# Vivado block design StreamingDataflowPartition_1, xc7z020clg400-1, Vivado 2020.1
create_bd_design StreamingDataflowPartition_1

create_bd_intf_port -mode Slave -vlnv xilinx.com:interface:axis_rtl:1.0 s_axis_0
set_property -dict [list \
  CONFIG.TDATA_NUM_BYTES 1 \
  CONFIG.TDEST_WIDTH 0 \
  CONFIG.TID_WIDTH 0 \
  CONFIG.TUSER_WIDTH 0 \
  CONFIG.HAS_TREADY 1 \
  CONFIG.HAS_TSTRB 0 \
  CONFIG.HAS_TKEEP 0 \
  CONFIG.HAS_TLAST 0 \
  CONFIG.FREQ_HZ 100000000.000000 \
  CONFIG.LAYERED_METADATA undef \
] [get_bd_intf_ports s_axis_0]
create_bd_intf_port -mode Master -vlnv xilinx.com:interface:axis_rtl:1.0 m_axis_0
set_property -dict {CONFIG.FREQ_HZ 100000000.000000} [get_bd_intf_ports m_axis_0]
create_bd_port -dir I -type clk ap_clk
set_property -dict {CONFIG.FREQ_HZ 100000000.000000} [get_bd_ports ap_clk]
create_bd_port -dir I -type rst ap_rst_n

create_bd_cell -type ip -vlnv xilinx.com:hls:StreamingDataflowPartition_1_StreamingFIFO_0:1.0 StreamingDataflowPartition_1_StreamingFIFO_0
create_bd_cell -type ip -vlnv xilinx.com:hls:StreamingDataflowPartition_1_Thresholding_Batch_0:1.0 StreamingDataflowPartition_1_Thresholding_Batch_0
create_bd_cell -type ip -vlnv xilinx.com:hls:StreamingDataflowPartition_1_StreamingDataWidthConverter_Batch_0:1.0 StreamingDataflowPartition_1_StreamingDataWidthConverter_Batch_0
create_bd_cell -type ip -vlnv xilinx.com:hls:StreamingDataflowPartition_1_ConvolutionInputGenerator_0:1.0 StreamingDataflowPartition_1_ConvolutionInputGenerator_0
create_bd_cell -type ip -vlnv xilinx.com:hls:StreamingDataflowPartition_1_StreamingFIFO_1:1.0 StreamingDataflowPartition_1_StreamingFIFO_1
create_bd_cell -type hier StreamingDataflowPartition_1_StreamingFCLayer_Batch_0
create_bd_cell -type ip -vlnv xilinx.com:hls:StreamingDataflowPartition_1_ConvolutionInputGenerator_1:1.0 StreamingDataflowPartition_1_ConvolutionInputGenerator_1
create_bd_cell -type ip -vlnv xilinx.com:hls:StreamingDataflowPartition_1_StreamingFIFO_2:1.0 StreamingDataflowPartition_1_StreamingFIFO_2
create_bd_cell -type hier StreamingDataflowPartition_1_StreamingFCLayer_Batch_1
create_bd_cell -type ip -vlnv xilinx.com:hls:StreamingDataflowPartition_1_StreamingDataWidthConverter_Batch_1:1.0 StreamingDataflowPartition_1_StreamingDataWidthConverter_Batch_1
create_bd_cell -type ip -vlnv xilinx.com:hls:StreamingDataflowPartition_1_StreamingMaxPool_Batch_0:1.0 StreamingDataflowPartition_1_StreamingMaxPool_Batch_0
create_bd_cell -type ip -vlnv xilinx.com:hls:StreamingDataflowPartition_1_StreamingDataWidthConverter_Batch_2:1.0 StreamingDataflowPartition_1_StreamingDataWidthConverter_Batch_2
create_bd_cell -type ip -vlnv xilinx.com:hls:StreamingDataflowPartition_1_ConvolutionInputGenerator_2:1.0 StreamingDataflowPartition_1_ConvolutionInputGenerator_2
create_bd_cell -type ip -vlnv xilinx.com:hls:StreamingDataflowPartition_1_StreamingFIFO_3:1.0 StreamingDataflowPartition_1_StreamingFIFO_3
create_bd_cell -type hier StreamingDataflowPartition_1_StreamingFCLayer_Batch_2
create_bd_cell -type ip -vlnv xilinx.com:hls:StreamingDataflowPartition_1_ConvolutionInputGenerator_3:1.0 StreamingDataflowPartition_1_ConvolutionInputGenerator_3
create_bd_cell -type ip -vlnv xilinx.com:hls:StreamingDataflowPartition_1_StreamingFIFO_4:1.0 StreamingDataflowPartition_1_StreamingFIFO_4
create_bd_cell -type hier StreamingDataflowPartition_1_StreamingFCLayer_Batch_3
create_bd_cell -type ip -vlnv xilinx.com:hls:StreamingDataflowPartition_1_StreamingDataWidthConverter_Batch_3:1.0 StreamingDataflowPartition_1_StreamingDataWidthConverter_Batch_3
create_bd_cell -type ip -vlnv xilinx.com:hls:StreamingDataflowPartition_1_StreamingMaxPool_Batch_1:1.0 StreamingDataflowPartition_1_StreamingMaxPool_Batch_1
create_bd_cell -type ip -vlnv xilinx.com:hls:StreamingDataflowPartition_1_StreamingDataWidthConverter_Batch_4:1.0 StreamingDataflowPartition_1_StreamingDataWidthConverter_Batch_4
create_bd_cell -type ip -vlnv xilinx.com:hls:StreamingDataflowPartition_1_ConvolutionInputGenerator_4:1.0 StreamingDataflowPartition_1_ConvolutionInputGenerator_4
create_bd_cell -type ip -vlnv xilinx.com:hls:StreamingDataflowPartition_1_StreamingFIFO_5:1.0 StreamingDataflowPartition_1_StreamingFIFO_5
create_bd_cell -type hier StreamingDataflowPartition_1_StreamingFCLayer_Batch_4
create_bd_cell -type ip -vlnv xilinx.com:hls:StreamingDataflowPartition_1_StreamingDataWidthConverter_Batch_5:1.0 StreamingDataflowPartition_1_StreamingDataWidthConverter_Batch_5
create_bd_cell -type ip -vlnv xilinx.com:hls:StreamingDataflowPartition_1_ConvolutionInputGenerator_5:1.0 StreamingDataflowPartition_1_ConvolutionInputGenerator_5
create_bd_cell -type hier StreamingDataflowPartition_1_StreamingFCLayer_Batch_5
create_bd_cell -type ip -vlnv xilinx.com:hls:StreamingDataflowPartition_1_StreamingDataWidthConverter_Batch_6:1.0 StreamingDataflowPartition_1_StreamingDataWidthConverter_Batch_6
create_bd_cell -type hier StreamingDataflowPartition_1_StreamingFCLayer_Batch_6
create_bd_cell -type ip -vlnv xilinx.com:hls:StreamingDataflowPartition_1_StreamingDataWidthConverter_Batch_7:1.0 StreamingDataflowPartition_1_StreamingDataWidthConverter_Batch_7
create_bd_cell -type ip -vlnv xilinx.com:hls:StreamingDataflowPartition_1_StreamingFIFO_6:1.0 StreamingDataflowPartition_1_StreamingFIFO_6
create_bd_cell -type hier StreamingDataflowPartition_1_StreamingFCLayer_Batch_7
create_bd_cell -type ip -vlnv xilinx.com:hls:StreamingDataflowPartition_1_StreamingFIFO_7:1.0 StreamingDataflowPartition_1_StreamingFIFO_7
create_bd_cell -type hier StreamingDataflowPartition_1_StreamingFCLayer_Batch_8
create_bd_cell -type ip -vlnv xilinx.com:hls:StreamingDataflowPartition_1_StreamingDataWidthConverter_Batch_8:1.0 StreamingDataflowPartition_1_StreamingDataWidthConverter_Batch_8
create_bd_cell -type ip -vlnv xilinx.com:hls:StreamingDataflowPartition_1_LabelSelect_Batch_0:1.0 StreamingDataflowPartition_1_LabelSelect_Batch_0
create_bd_cell -type ip -vlnv xilinx.com:hls:StreamingDataflowPartition_1_StreamingFIFO_8:1.0 StreamingDataflowPartition_1_StreamingFIFO_8

# ---- hierarchy /StreamingDataflowPartition_1_StreamingFCLayer_Batch_0 ----
current_bd_instance /StreamingDataflowPartition_1_StreamingFCLayer_Batch_0
create_bd_intf_pin -mode Master -vlnv xilinx.com:interface:axis_rtl:1.0 out_V_V
create_bd_intf_pin -mode Slave -vlnv xilinx.com:interface:axis_rtl:1.0 in0_V_V
create_bd_pin -dir I -type clk ap_clk
create_bd_pin -dir I -type rst ap_rst_n

create_bd_cell -type ip -vlnv xilinx.com:hls:StreamingDataflowPartition_1_StreamingFCLayer_Batch_0:1.0 StreamingDataflowPartition_1_StreamingFCLayer_Batch_0
create_bd_cell -type ip -vlnv xilinx.com:user:memstream:1.0 StreamingDataflowPartition_1_StreamingFCLayer_Batch_0_wstrm
set_property -dict [list \
  CONFIG.MEM_DEPTH 36 \
  CONFIG.MEM_INIT /mnt/HLSNAS/nthu02/FINN_vision/finn/build/dir/code_gen_ipgen_StreamingDataflowPartition_1_StreamingFCLayer_Batch_0_kid44056/ \
  CONFIG.MEM_WIDTH 48 \
  CONFIG.NSTREAMS 1 \
  CONFIG.RAM_STYLE auto \
  CONFIG.STRM0_DEPTH 36 \
  CONFIG.STRM0_OFFSET 0 \
  CONFIG.STRM0_WIDTH 48 \
] [get_bd_cells StreamingDataflowPartition_1_StreamingFCLayer_Batch_0_wstrm]

# ---- hierarchy /StreamingDataflowPartition_1_StreamingFCLayer_Batch_1 ----
current_bd_instance /StreamingDataflowPartition_1_StreamingFCLayer_Batch_1
create_bd_intf_pin -mode Master -vlnv xilinx.com:interface:axis_rtl:1.0 out_V_V
create_bd_intf_pin -mode Slave -vlnv xilinx.com:interface:axis_rtl:1.0 in0_V_V
create_bd_pin -dir I -type clk ap_clk
create_bd_pin -dir I -type rst ap_rst_n

create_bd_cell -type ip -vlnv xilinx.com:hls:StreamingDataflowPartition_1_StreamingFCLayer_Batch_1:1.0 StreamingDataflowPartition_1_StreamingFCLayer_Batch_1
create_bd_cell -type ip -vlnv xilinx.com:user:memstream:1.0 StreamingDataflowPartition_1_StreamingFCLayer_Batch_1_wstrm
set_property -dict [list \
  CONFIG.MEM_DEPTH 72 \
  CONFIG.MEM_INIT /mnt/HLSNAS/nthu02/FINN_vision/finn/build/dir/code_gen_ipgen_StreamingDataflowPartition_1_StreamingFCLayer_Batch_1_rlyb3f5l/ \
  CONFIG.MEM_WIDTH 512 \
  CONFIG.NSTREAMS 1 \
  CONFIG.RAM_STYLE auto \
  CONFIG.STRM0_DEPTH 72 \
  CONFIG.STRM0_OFFSET 0 \
  CONFIG.STRM0_WIDTH 512 \
] [get_bd_cells StreamingDataflowPartition_1_StreamingFCLayer_Batch_1_wstrm]

# ---- hierarchy /StreamingDataflowPartition_1_StreamingFCLayer_Batch_2 ----
current_bd_instance /StreamingDataflowPartition_1_StreamingFCLayer_Batch_2
create_bd_intf_pin -mode Master -vlnv xilinx.com:interface:axis_rtl:1.0 out_V_V
create_bd_intf_pin -mode Slave -vlnv xilinx.com:interface:axis_rtl:1.0 in0_V_V
create_bd_pin -dir I -type clk ap_clk
create_bd_pin -dir I -type rst ap_rst_n

create_bd_cell -type ip -vlnv xilinx.com:hls:StreamingDataflowPartition_1_StreamingFCLayer_Batch_2:1.0 StreamingDataflowPartition_1_StreamingFCLayer_Batch_2
create_bd_cell -type ip -vlnv xilinx.com:user:memstream:1.0 StreamingDataflowPartition_1_StreamingFCLayer_Batch_2_wstrm
set_property -dict [list \
  CONFIG.MEM_DEPTH 288 \
  CONFIG.MEM_INIT /mnt/HLSNAS/nthu02/FINN_vision/finn/build/dir/code_gen_ipgen_StreamingDataflowPartition_1_StreamingFCLayer_Batch_2_vsby_qo2/ \
  CONFIG.MEM_WIDTH 256 \
  CONFIG.NSTREAMS 1 \
  CONFIG.RAM_STYLE auto \
  CONFIG.STRM0_DEPTH 288 \
  CONFIG.STRM0_OFFSET 0 \
  CONFIG.STRM0_WIDTH 256 \
] [get_bd_cells StreamingDataflowPartition_1_StreamingFCLayer_Batch_2_wstrm]

# ---- hierarchy /StreamingDataflowPartition_1_StreamingFCLayer_Batch_3 ----
current_bd_instance /StreamingDataflowPartition_1_StreamingFCLayer_Batch_3
create_bd_intf_pin -mode Master -vlnv xilinx.com:interface:axis_rtl:1.0 out_V_V
create_bd_intf_pin -mode Slave -vlnv xilinx.com:interface:axis_rtl:1.0 in0_V_V
create_bd_pin -dir I -type clk ap_clk
create_bd_pin -dir I -type rst ap_rst_n

create_bd_cell -type ip -vlnv xilinx.com:hls:StreamingDataflowPartition_1_StreamingFCLayer_Batch_3:1.0 StreamingDataflowPartition_1_StreamingFCLayer_Batch_3
create_bd_cell -type ip -vlnv xilinx.com:user:memstream:1.0 StreamingDataflowPartition_1_StreamingFCLayer_Batch_3_wstrm
set_property -dict [list \
  CONFIG.MEM_DEPTH 576 \
  CONFIG.MEM_INIT /mnt/HLSNAS/nthu02/FINN_vision/finn/build/dir/code_gen_ipgen_StreamingDataflowPartition_1_StreamingFCLayer_Batch_3__u8l5m1b/ \
  CONFIG.MEM_WIDTH 256 \
  CONFIG.NSTREAMS 1 \
  CONFIG.RAM_STYLE auto \
  CONFIG.STRM0_DEPTH 576 \
  CONFIG.STRM0_OFFSET 0 \
  CONFIG.STRM0_WIDTH 256 \
] [get_bd_cells StreamingDataflowPartition_1_StreamingFCLayer_Batch_3_wstrm]

# ---- hierarchy /StreamingDataflowPartition_1_StreamingFCLayer_Batch_4 ----
current_bd_instance /StreamingDataflowPartition_1_StreamingFCLayer_Batch_4
create_bd_intf_pin -mode Master -vlnv xilinx.com:interface:axis_rtl:1.0 out_V_V
create_bd_intf_pin -mode Slave -vlnv xilinx.com:interface:axis_rtl:1.0 in0_V_V
create_bd_pin -dir I -type clk ap_clk
create_bd_pin -dir I -type rst ap_rst_n

create_bd_cell -type ip -vlnv xilinx.com:hls:StreamingDataflowPartition_1_StreamingFCLayer_Batch_4:1.0 StreamingDataflowPartition_1_StreamingFCLayer_Batch_4
create_bd_cell -type ip -vlnv xilinx.com:user:memstream:1.0 StreamingDataflowPartition_1_StreamingFCLayer_Batch_4_wstrm
set_property -dict [list \
  CONFIG.MEM_DEPTH 4608 \
  CONFIG.MEM_INIT /mnt/HLSNAS/nthu02/FINN_vision/finn/build/dir/code_gen_ipgen_StreamingDataflowPartition_1_StreamingFCLayer_Batch_4_t3s34udo/ \
  CONFIG.MEM_WIDTH 64 \
  CONFIG.NSTREAMS 1 \
  CONFIG.RAM_STYLE auto \
  CONFIG.STRM0_DEPTH 4608 \
  CONFIG.STRM0_OFFSET 0 \
  CONFIG.STRM0_WIDTH 64 \
] [get_bd_cells StreamingDataflowPartition_1_StreamingFCLayer_Batch_4_wstrm]

# ---- hierarchy /StreamingDataflowPartition_1_StreamingFCLayer_Batch_5 ----
current_bd_instance /StreamingDataflowPartition_1_StreamingFCLayer_Batch_5
create_bd_intf_pin -mode Master -vlnv xilinx.com:interface:axis_rtl:1.0 out_V_V
create_bd_intf_pin -mode Slave -vlnv xilinx.com:interface:axis_rtl:1.0 in0_V_V
create_bd_pin -dir I -type clk ap_clk
create_bd_pin -dir I -type rst ap_rst_n

create_bd_cell -type ip -vlnv xilinx.com:hls:StreamingDataflowPartition_1_StreamingFCLayer_Batch_5:1.0 StreamingDataflowPartition_1_StreamingFCLayer_Batch_5
create_bd_cell -type ip -vlnv xilinx.com:user:memstream:1.0 StreamingDataflowPartition_1_StreamingFCLayer_Batch_5_wstrm
set_property -dict [list \
  CONFIG.MEM_DEPTH 36864 \
  CONFIG.MEM_INIT /mnt/HLSNAS/nthu02/FINN_vision/finn/build/dir/code_gen_ipgen_StreamingDataflowPartition_1_StreamingFCLayer_Batch_5_xarv85n1/ \
  CONFIG.MEM_WIDTH 16 \
  CONFIG.NSTREAMS 1 \
  CONFIG.RAM_STYLE auto \
  CONFIG.STRM0_DEPTH 36864 \
  CONFIG.STRM0_OFFSET 0 \
  CONFIG.STRM0_WIDTH 16 \
] [get_bd_cells StreamingDataflowPartition_1_StreamingFCLayer_Batch_5_wstrm]

# ---- hierarchy /StreamingDataflowPartition_1_StreamingFCLayer_Batch_6 ----
current_bd_instance /StreamingDataflowPartition_1_StreamingFCLayer_Batch_6
create_bd_intf_pin -mode Master -vlnv xilinx.com:interface:axis_rtl:1.0 out_V_V
create_bd_intf_pin -mode Slave -vlnv xilinx.com:interface:axis_rtl:1.0 in0_V_V
create_bd_pin -dir I -type clk ap_clk
create_bd_pin -dir I -type rst ap_rst_n

create_bd_cell -type ip -vlnv xilinx.com:hls:StreamingDataflowPartition_1_StreamingFCLayer_Batch_6:1.0 StreamingDataflowPartition_1_StreamingFCLayer_Batch_6
create_bd_cell -type ip -vlnv xilinx.com:user:memstream:1.0 StreamingDataflowPartition_1_StreamingFCLayer_Batch_6_wstrm
set_property -dict [list \
  CONFIG.MEM_DEPTH 32768 \
  CONFIG.MEM_INIT /mnt/HLSNAS/nthu02/FINN_vision/finn/build/dir/code_gen_ipgen_StreamingDataflowPartition_1_StreamingFCLayer_Batch_6_dl_v0rnd/ \
  CONFIG.MEM_WIDTH 8 \
  CONFIG.NSTREAMS 1 \
  CONFIG.RAM_STYLE auto \
  CONFIG.STRM0_DEPTH 32768 \
  CONFIG.STRM0_OFFSET 0 \
  CONFIG.STRM0_WIDTH 8 \
] [get_bd_cells StreamingDataflowPartition_1_StreamingFCLayer_Batch_6_wstrm]

# ---- hierarchy /StreamingDataflowPartition_1_StreamingFCLayer_Batch_7 ----
current_bd_instance /StreamingDataflowPartition_1_StreamingFCLayer_Batch_7
create_bd_intf_pin -mode Master -vlnv xilinx.com:interface:axis_rtl:1.0 out_V_V
create_bd_intf_pin -mode Slave -vlnv xilinx.com:interface:axis_rtl:1.0 in0_V_V
create_bd_pin -dir I -type clk ap_clk
create_bd_pin -dir I -type rst ap_rst_n

create_bd_cell -type ip -vlnv xilinx.com:hls:StreamingDataflowPartition_1_StreamingFCLayer_Batch_7:1.0 StreamingDataflowPartition_1_StreamingFCLayer_Batch_7
create_bd_cell -type ip -vlnv xilinx.com:user:memstream:1.0 StreamingDataflowPartition_1_StreamingFCLayer_Batch_7_wstrm
set_property -dict [list \
  CONFIG.MEM_DEPTH 32768 \
  CONFIG.MEM_INIT /mnt/HLSNAS/nthu02/FINN_vision/finn/build/dir/code_gen_ipgen_StreamingDataflowPartition_1_StreamingFCLayer_Batch_7_xs5d2uis/ \
  CONFIG.MEM_WIDTH 8 \
  CONFIG.NSTREAMS 1 \
  CONFIG.RAM_STYLE auto \
  CONFIG.STRM0_DEPTH 32768 \
  CONFIG.STRM0_OFFSET 0 \
  CONFIG.STRM0_WIDTH 8 \
] [get_bd_cells StreamingDataflowPartition_1_StreamingFCLayer_Batch_7_wstrm]

# ---- hierarchy /StreamingDataflowPartition_1_StreamingFCLayer_Batch_8 ----
current_bd_instance /StreamingDataflowPartition_1_StreamingFCLayer_Batch_8
create_bd_intf_pin -mode Master -vlnv xilinx.com:interface:axis_rtl:1.0 out_V_V
create_bd_intf_pin -mode Slave -vlnv xilinx.com:interface:axis_rtl:1.0 in0_V_V
create_bd_pin -dir I -type clk ap_clk
create_bd_pin -dir I -type rst ap_rst_n

create_bd_cell -type ip -vlnv xilinx.com:hls:StreamingDataflowPartition_1_StreamingFCLayer_Batch_8:1.0 StreamingDataflowPartition_1_StreamingFCLayer_Batch_8
create_bd_cell -type ip -vlnv xilinx.com:user:memstream:1.0 StreamingDataflowPartition_1_StreamingFCLayer_Batch_8_wstrm
set_property -dict [list \
  CONFIG.MEM_DEPTH 1024 \
  CONFIG.MEM_INIT /mnt/HLSNAS/nthu02/FINN_vision/finn/build/dir/code_gen_ipgen_StreamingDataflowPartition_1_StreamingFCLayer_Batch_8_pti02s77/ \
  CONFIG.MEM_WIDTH 8 \
  CONFIG.NSTREAMS 1 \
  CONFIG.RAM_STYLE auto \
  CONFIG.STRM0_DEPTH 1024 \
  CONFIG.STRM0_OFFSET 0 \
  CONFIG.STRM0_WIDTH 8 \
] [get_bd_cells StreamingDataflowPartition_1_StreamingFCLayer_Batch_8_wstrm]

# ---- connections ----

current_bd_instance /StreamingDataflowPartition_1_StreamingFCLayer_Batch_0
connect_bd_intf_net [get_bd_intf_pins StreamingDataflowPartition_1_StreamingFCLayer_Batch_0_wstrm/m_axis_0] [get_bd_intf_pins StreamingDataflowPartition_1_StreamingFCLayer_Batch_0/weights_V_V]
connect_bd_intf_net [get_bd_intf_pins in0_V_V] [get_bd_intf_pins StreamingDataflowPartition_1_StreamingFCLayer_Batch_0/in0_V_V]
connect_bd_intf_net [get_bd_intf_pins out_V_V] [get_bd_intf_pins StreamingDataflowPartition_1_StreamingFCLayer_Batch_0/out_V_V]
connect_bd_net [get_bd_pins ap_rst_n] \
  [get_bd_pins StreamingDataflowPartition_1_StreamingFCLayer_Batch_0_wstrm/aresetn] \
  [get_bd_pins StreamingDataflowPartition_1_StreamingFCLayer_Batch_0/ap_rst_n]
connect_bd_net [get_bd_pins ap_clk] \
  [get_bd_pins StreamingDataflowPartition_1_StreamingFCLayer_Batch_0_wstrm/aclk] \
  [get_bd_pins StreamingDataflowPartition_1_StreamingFCLayer_Batch_0/ap_clk]

current_bd_instance /StreamingDataflowPartition_1_StreamingFCLayer_Batch_1
connect_bd_intf_net [get_bd_intf_pins StreamingDataflowPartition_1_StreamingFCLayer_Batch_1_wstrm/m_axis_0] [get_bd_intf_pins StreamingDataflowPartition_1_StreamingFCLayer_Batch_1/weights_V_V]
connect_bd_intf_net [get_bd_intf_pins in0_V_V] [get_bd_intf_pins StreamingDataflowPartition_1_StreamingFCLayer_Batch_1/in0_V_V]
connect_bd_intf_net [get_bd_intf_pins out_V_V] [get_bd_intf_pins StreamingDataflowPartition_1_StreamingFCLayer_Batch_1/out_V_V]
connect_bd_net [get_bd_pins ap_rst_n] \
  [get_bd_pins StreamingDataflowPartition_1_StreamingFCLayer_Batch_1_wstrm/aresetn] \
  [get_bd_pins StreamingDataflowPartition_1_StreamingFCLayer_Batch_1/ap_rst_n]
connect_bd_net [get_bd_pins ap_clk] \
  [get_bd_pins StreamingDataflowPartition_1_StreamingFCLayer_Batch_1_wstrm/aclk] \
  [get_bd_pins StreamingDataflowPartition_1_StreamingFCLayer_Batch_1/ap_clk]

current_bd_instance /StreamingDataflowPartition_1_StreamingFCLayer_Batch_2
connect_bd_intf_net [get_bd_intf_pins StreamingDataflowPartition_1_StreamingFCLayer_Batch_2_wstrm/m_axis_0] [get_bd_intf_pins StreamingDataflowPartition_1_StreamingFCLayer_Batch_2/weights_V_V]
connect_bd_intf_net [get_bd_intf_pins in0_V_V] [get_bd_intf_pins StreamingDataflowPartition_1_StreamingFCLayer_Batch_2/in0_V_V]
connect_bd_intf_net [get_bd_intf_pins out_V_V] [get_bd_intf_pins StreamingDataflowPartition_1_StreamingFCLayer_Batch_2/out_V_V]
connect_bd_net [get_bd_pins ap_rst_n] \
  [get_bd_pins StreamingDataflowPartition_1_StreamingFCLayer_Batch_2_wstrm/aresetn] \
  [get_bd_pins StreamingDataflowPartition_1_StreamingFCLayer_Batch_2/ap_rst_n]
connect_bd_net [get_bd_pins ap_clk] \
  [get_bd_pins StreamingDataflowPartition_1_StreamingFCLayer_Batch_2_wstrm/aclk] \
  [get_bd_pins StreamingDataflowPartition_1_StreamingFCLayer_Batch_2/ap_clk]

current_bd_instance /StreamingDataflowPartition_1_StreamingFCLayer_Batch_3
connect_bd_intf_net [get_bd_intf_pins StreamingDataflowPartition_1_StreamingFCLayer_Batch_3_wstrm/m_axis_0] [get_bd_intf_pins StreamingDataflowPartition_1_StreamingFCLayer_Batch_3/weights_V_V]
connect_bd_intf_net [get_bd_intf_pins in0_V_V] [get_bd_intf_pins StreamingDataflowPartition_1_StreamingFCLayer_Batch_3/in0_V_V]
connect_bd_intf_net [get_bd_intf_pins out_V_V] [get_bd_intf_pins StreamingDataflowPartition_1_StreamingFCLayer_Batch_3/out_V_V]
connect_bd_net [get_bd_pins ap_rst_n] \
  [get_bd_pins StreamingDataflowPartition_1_StreamingFCLayer_Batch_3_wstrm/aresetn] \
  [get_bd_pins StreamingDataflowPartition_1_StreamingFCLayer_Batch_3/ap_rst_n]
connect_bd_net [get_bd_pins ap_clk] \
  [get_bd_pins StreamingDataflowPartition_1_StreamingFCLayer_Batch_3_wstrm/aclk] \
  [get_bd_pins StreamingDataflowPartition_1_StreamingFCLayer_Batch_3/ap_clk]

current_bd_instance /StreamingDataflowPartition_1_StreamingFCLayer_Batch_4
connect_bd_intf_net [get_bd_intf_pins StreamingDataflowPartition_1_StreamingFCLayer_Batch_4_wstrm/m_axis_0] [get_bd_intf_pins StreamingDataflowPartition_1_StreamingFCLayer_Batch_4/weights_V_V]
connect_bd_intf_net [get_bd_intf_pins in0_V_V] [get_bd_intf_pins StreamingDataflowPartition_1_StreamingFCLayer_Batch_4/in0_V_V]
connect_bd_intf_net [get_bd_intf_pins out_V_V] [get_bd_intf_pins StreamingDataflowPartition_1_StreamingFCLayer_Batch_4/out_V_V]
connect_bd_net [get_bd_pins ap_rst_n] \
  [get_bd_pins StreamingDataflowPartition_1_StreamingFCLayer_Batch_4_wstrm/aresetn] \
  [get_bd_pins StreamingDataflowPartition_1_StreamingFCLayer_Batch_4/ap_rst_n]
connect_bd_net [get_bd_pins ap_clk] \
  [get_bd_pins StreamingDataflowPartition_1_StreamingFCLayer_Batch_4_wstrm/aclk] \
  [get_bd_pins StreamingDataflowPartition_1_StreamingFCLayer_Batch_4/ap_clk]

current_bd_instance /StreamingDataflowPartition_1_StreamingFCLayer_Batch_5
connect_bd_intf_net [get_bd_intf_pins StreamingDataflowPartition_1_StreamingFCLayer_Batch_5_wstrm/m_axis_0] [get_bd_intf_pins StreamingDataflowPartition_1_StreamingFCLayer_Batch_5/weights_V_V]
connect_bd_intf_net [get_bd_intf_pins in0_V_V] [get_bd_intf_pins StreamingDataflowPartition_1_StreamingFCLayer_Batch_5/in0_V_V]
connect_bd_intf_net [get_bd_intf_pins out_V_V] [get_bd_intf_pins StreamingDataflowPartition_1_StreamingFCLayer_Batch_5/out_V_V]
connect_bd_net [get_bd_pins ap_rst_n] \
  [get_bd_pins StreamingDataflowPartition_1_StreamingFCLayer_Batch_5_wstrm/aresetn] \
  [get_bd_pins StreamingDataflowPartition_1_StreamingFCLayer_Batch_5/ap_rst_n]
connect_bd_net [get_bd_pins ap_clk] \
  [get_bd_pins StreamingDataflowPartition_1_StreamingFCLayer_Batch_5_wstrm/aclk] \
  [get_bd_pins StreamingDataflowPartition_1_StreamingFCLayer_Batch_5/ap_clk]

current_bd_instance /StreamingDataflowPartition_1_StreamingFCLayer_Batch_6
connect_bd_intf_net [get_bd_intf_pins StreamingDataflowPartition_1_StreamingFCLayer_Batch_6_wstrm/m_axis_0] [get_bd_intf_pins StreamingDataflowPartition_1_StreamingFCLayer_Batch_6/weights_V_V]
connect_bd_intf_net [get_bd_intf_pins in0_V_V] [get_bd_intf_pins StreamingDataflowPartition_1_StreamingFCLayer_Batch_6/in0_V_V]
connect_bd_intf_net [get_bd_intf_pins out_V_V] [get_bd_intf_pins StreamingDataflowPartition_1_StreamingFCLayer_Batch_6/out_V_V]
connect_bd_net [get_bd_pins ap_rst_n] \
  [get_bd_pins StreamingDataflowPartition_1_StreamingFCLayer_Batch_6_wstrm/aresetn] \
  [get_bd_pins StreamingDataflowPartition_1_StreamingFCLayer_Batch_6/ap_rst_n]
connect_bd_net [get_bd_pins ap_clk] \
  [get_bd_pins StreamingDataflowPartition_1_StreamingFCLayer_Batch_6_wstrm/aclk] \
  [get_bd_pins StreamingDataflowPartition_1_StreamingFCLayer_Batch_6/ap_clk]

current_bd_instance /StreamingDataflowPartition_1_StreamingFCLayer_Batch_7
connect_bd_intf_net [get_bd_intf_pins StreamingDataflowPartition_1_StreamingFCLayer_Batch_7_wstrm/m_axis_0] [get_bd_intf_pins StreamingDataflowPartition_1_StreamingFCLayer_Batch_7/weights_V_V]
connect_bd_intf_net [get_bd_intf_pins in0_V_V] [get_bd_intf_pins StreamingDataflowPartition_1_StreamingFCLayer_Batch_7/in0_V_V]
connect_bd_intf_net [get_bd_intf_pins out_V_V] [get_bd_intf_pins StreamingDataflowPartition_1_StreamingFCLayer_Batch_7/out_V_V]
connect_bd_net [get_bd_pins ap_rst_n] \
  [get_bd_pins StreamingDataflowPartition_1_StreamingFCLayer_Batch_7_wstrm/aresetn] \
  [get_bd_pins StreamingDataflowPartition_1_StreamingFCLayer_Batch_7/ap_rst_n]
connect_bd_net [get_bd_pins ap_clk] \
  [get_bd_pins StreamingDataflowPartition_1_StreamingFCLayer_Batch_7_wstrm/aclk] \
  [get_bd_pins StreamingDataflowPartition_1_StreamingFCLayer_Batch_7/ap_clk]

current_bd_instance /StreamingDataflowPartition_1_StreamingFCLayer_Batch_8
connect_bd_intf_net [get_bd_intf_pins StreamingDataflowPartition_1_StreamingFCLayer_Batch_8_wstrm/m_axis_0] [get_bd_intf_pins StreamingDataflowPartition_1_StreamingFCLayer_Batch_8/weights_V_V]
connect_bd_intf_net [get_bd_intf_pins in0_V_V] [get_bd_intf_pins StreamingDataflowPartition_1_StreamingFCLayer_Batch_8/in0_V_V]
connect_bd_intf_net [get_bd_intf_pins out_V_V] [get_bd_intf_pins StreamingDataflowPartition_1_StreamingFCLayer_Batch_8/out_V_V]
connect_bd_net [get_bd_pins ap_rst_n] \
  [get_bd_pins StreamingDataflowPartition_1_StreamingFCLayer_Batch_8_wstrm/aresetn] \
  [get_bd_pins StreamingDataflowPartition_1_StreamingFCLayer_Batch_8/ap_rst_n]
connect_bd_net [get_bd_pins ap_clk] \
  [get_bd_pins StreamingDataflowPartition_1_StreamingFCLayer_Batch_8_wstrm/aclk] \
  [get_bd_pins StreamingDataflowPartition_1_StreamingFCLayer_Batch_8/ap_clk]

current_bd_instance /
connect_bd_intf_net -intf_net in0_V_V_0_1 [get_bd_intf_ports s_axis_0] [get_bd_intf_pins StreamingDataflowPartition_1_StreamingFIFO_0/in0_V_V]
connect_bd_intf_net [get_bd_intf_pins StreamingDataflowPartition_1_ConvolutionInputGenerator_3/out_V_V] [get_bd_intf_pins StreamingDataflowPartition_1_StreamingFIFO_4/in0_V_V]
connect_bd_intf_net [get_bd_intf_pins StreamingDataflowPartition_1_StreamingFIFO_0/out_V_V] [get_bd_intf_pins StreamingDataflowPartition_1_Thresholding_Batch_0/in0_V_V]
connect_bd_intf_net [get_bd_intf_pins StreamingDataflowPartition_1_Thresholding_Batch_0/out_V_V] [get_bd_intf_pins StreamingDataflowPartition_1_StreamingDataWidthConverter_Batch_0/in0_V_V]
connect_bd_intf_net [get_bd_intf_pins StreamingDataflowPartition_1_StreamingDataWidthConverter_Batch_0/out_V_V] [get_bd_intf_pins StreamingDataflowPartition_1_ConvolutionInputGenerator_0/in0_V_V]
connect_bd_intf_net [get_bd_intf_pins StreamingDataflowPartition_1_ConvolutionInputGenerator_0/out_V_V] [get_bd_intf_pins StreamingDataflowPartition_1_StreamingFIFO_1/in0_V_V]
connect_bd_intf_net [get_bd_intf_pins StreamingDataflowPartition_1_StreamingFIFO_1/out_V_V] [get_bd_intf_pins StreamingDataflowPartition_1_StreamingFCLayer_Batch_0/in0_V_V]
connect_bd_intf_net [get_bd_intf_pins StreamingDataflowPartition_1_StreamingFCLayer_Batch_0/out_V_V] [get_bd_intf_pins StreamingDataflowPartition_1_ConvolutionInputGenerator_1/in0_V_V]
connect_bd_intf_net [get_bd_intf_pins StreamingDataflowPartition_1_ConvolutionInputGenerator_1/out_V_V] [get_bd_intf_pins StreamingDataflowPartition_1_StreamingFIFO_2/in0_V_V]
connect_bd_intf_net [get_bd_intf_pins StreamingDataflowPartition_1_StreamingFIFO_2/out_V_V] [get_bd_intf_pins StreamingDataflowPartition_1_StreamingFCLayer_Batch_1/in0_V_V]
connect_bd_intf_net [get_bd_intf_pins StreamingDataflowPartition_1_StreamingFCLayer_Batch_1/out_V_V] [get_bd_intf_pins StreamingDataflowPartition_1_StreamingDataWidthConverter_Batch_1/in0_V_V]
connect_bd_intf_net [get_bd_intf_pins StreamingDataflowPartition_1_StreamingDataWidthConverter_Batch_1/out_V_V] [get_bd_intf_pins StreamingDataflowPartition_1_StreamingMaxPool_Batch_0/in0_V_V]
connect_bd_intf_net [get_bd_intf_pins StreamingDataflowPartition_1_StreamingMaxPool_Batch_0/out_V_V] [get_bd_intf_pins StreamingDataflowPartition_1_StreamingDataWidthConverter_Batch_2/in0_V_V]
connect_bd_intf_net [get_bd_intf_pins StreamingDataflowPartition_1_StreamingDataWidthConverter_Batch_2/out_V_V] [get_bd_intf_pins StreamingDataflowPartition_1_ConvolutionInputGenerator_2/in0_V_V]
connect_bd_intf_net [get_bd_intf_pins StreamingDataflowPartition_1_ConvolutionInputGenerator_2/out_V_V] [get_bd_intf_pins StreamingDataflowPartition_1_StreamingFIFO_3/in0_V_V]
connect_bd_intf_net [get_bd_intf_pins StreamingDataflowPartition_1_StreamingFIFO_3/out_V_V] [get_bd_intf_pins StreamingDataflowPartition_1_StreamingFCLayer_Batch_2/in0_V_V]
connect_bd_intf_net [get_bd_intf_pins StreamingDataflowPartition_1_StreamingFCLayer_Batch_2/out_V_V] [get_bd_intf_pins StreamingDataflowPartition_1_ConvolutionInputGenerator_3/in0_V_V]
connect_bd_intf_net [get_bd_intf_pins StreamingDataflowPartition_1_StreamingFIFO_4/out_V_V] [get_bd_intf_pins StreamingDataflowPartition_1_StreamingFCLayer_Batch_3/in0_V_V]
connect_bd_intf_net [get_bd_intf_pins StreamingDataflowPartition_1_StreamingFCLayer_Batch_3/out_V_V] [get_bd_intf_pins StreamingDataflowPartition_1_StreamingDataWidthConverter_Batch_3/in0_V_V]
connect_bd_intf_net [get_bd_intf_pins StreamingDataflowPartition_1_StreamingDataWidthConverter_Batch_3/out_V_V] [get_bd_intf_pins StreamingDataflowPartition_1_StreamingMaxPool_Batch_1/in0_V_V]
connect_bd_intf_net [get_bd_intf_pins StreamingDataflowPartition_1_StreamingMaxPool_Batch_1/out_V_V] [get_bd_intf_pins StreamingDataflowPartition_1_StreamingDataWidthConverter_Batch_4/in0_V_V]
connect_bd_intf_net [get_bd_intf_pins StreamingDataflowPartition_1_StreamingDataWidthConverter_Batch_4/out_V_V] [get_bd_intf_pins StreamingDataflowPartition_1_ConvolutionInputGenerator_4/in0_V_V]
connect_bd_intf_net [get_bd_intf_pins StreamingDataflowPartition_1_ConvolutionInputGenerator_4/out_V_V] [get_bd_intf_pins StreamingDataflowPartition_1_StreamingFIFO_5/in0_V_V]
connect_bd_intf_net [get_bd_intf_pins StreamingDataflowPartition_1_StreamingFIFO_5/out_V_V] [get_bd_intf_pins StreamingDataflowPartition_1_StreamingFCLayer_Batch_4/in0_V_V]
connect_bd_intf_net [get_bd_intf_pins StreamingDataflowPartition_1_StreamingFCLayer_Batch_4/out_V_V] [get_bd_intf_pins StreamingDataflowPartition_1_StreamingDataWidthConverter_Batch_5/in0_V_V]
connect_bd_intf_net [get_bd_intf_pins StreamingDataflowPartition_1_StreamingDataWidthConverter_Batch_5/out_V_V] [get_bd_intf_pins StreamingDataflowPartition_1_ConvolutionInputGenerator_5/in0_V_V]
connect_bd_intf_net [get_bd_intf_pins StreamingDataflowPartition_1_ConvolutionInputGenerator_5/out_V_V] [get_bd_intf_pins StreamingDataflowPartition_1_StreamingFCLayer_Batch_5/in0_V_V]
connect_bd_intf_net [get_bd_intf_pins StreamingDataflowPartition_1_StreamingFCLayer_Batch_5/out_V_V] [get_bd_intf_pins StreamingDataflowPartition_1_StreamingDataWidthConverter_Batch_6/in0_V_V]
connect_bd_intf_net [get_bd_intf_pins StreamingDataflowPartition_1_StreamingDataWidthConverter_Batch_6/out_V_V] [get_bd_intf_pins StreamingDataflowPartition_1_StreamingFCLayer_Batch_6/in0_V_V]
connect_bd_intf_net [get_bd_intf_pins StreamingDataflowPartition_1_StreamingFCLayer_Batch_6/out_V_V] [get_bd_intf_pins StreamingDataflowPartition_1_StreamingDataWidthConverter_Batch_7/in0_V_V]
connect_bd_intf_net [get_bd_intf_pins StreamingDataflowPartition_1_StreamingDataWidthConverter_Batch_7/out_V_V] [get_bd_intf_pins StreamingDataflowPartition_1_StreamingFIFO_6/in0_V_V]
connect_bd_intf_net [get_bd_intf_pins StreamingDataflowPartition_1_StreamingFIFO_6/out_V_V] [get_bd_intf_pins StreamingDataflowPartition_1_StreamingFCLayer_Batch_7/in0_V_V]
connect_bd_intf_net [get_bd_intf_pins StreamingDataflowPartition_1_StreamingFCLayer_Batch_7/out_V_V] [get_bd_intf_pins StreamingDataflowPartition_1_StreamingFIFO_7/in0_V_V]
connect_bd_intf_net [get_bd_intf_pins StreamingDataflowPartition_1_StreamingFIFO_7/out_V_V] [get_bd_intf_pins StreamingDataflowPartition_1_StreamingFCLayer_Batch_8/in0_V_V]
connect_bd_intf_net [get_bd_intf_pins StreamingDataflowPartition_1_StreamingFCLayer_Batch_8/out_V_V] [get_bd_intf_pins StreamingDataflowPartition_1_StreamingDataWidthConverter_Batch_8/in0_V_V]
connect_bd_intf_net [get_bd_intf_pins StreamingDataflowPartition_1_StreamingDataWidthConverter_Batch_8/out_V_V] [get_bd_intf_pins StreamingDataflowPartition_1_LabelSelect_Batch_0/in0_V_V]
connect_bd_intf_net [get_bd_intf_pins StreamingDataflowPartition_1_LabelSelect_Batch_0/out_V_V] [get_bd_intf_pins StreamingDataflowPartition_1_StreamingFIFO_8/in0_V_V]
connect_bd_intf_net [get_bd_intf_ports m_axis_0] [get_bd_intf_pins StreamingDataflowPartition_1_StreamingFIFO_8/out_V_V]
connect_bd_net -net ap_clk_0_1 [get_bd_ports ap_clk] \
  [get_bd_pins StreamingDataflowPartition_1_StreamingFIFO_0/ap_clk] \
  [get_bd_pins StreamingDataflowPartition_1_Thresholding_Batch_0/ap_clk] \
  [get_bd_pins StreamingDataflowPartition_1_StreamingDataWidthConverter_Batch_0/ap_clk] \
  [get_bd_pins StreamingDataflowPartition_1_ConvolutionInputGenerator_0/ap_clk] \
  [get_bd_pins StreamingDataflowPartition_1_StreamingFIFO_1/ap_clk] \
  [get_bd_pins StreamingDataflowPartition_1_StreamingFCLayer_Batch_0/ap_clk] \
  [get_bd_pins StreamingDataflowPartition_1_ConvolutionInputGenerator_1/ap_clk] \
  [get_bd_pins StreamingDataflowPartition_1_StreamingFIFO_2/ap_clk] \
  [get_bd_pins StreamingDataflowPartition_1_StreamingFCLayer_Batch_1/ap_clk] \
  [get_bd_pins StreamingDataflowPartition_1_StreamingDataWidthConverter_Batch_1/ap_clk] \
  [get_bd_pins StreamingDataflowPartition_1_StreamingMaxPool_Batch_0/ap_clk] \
  [get_bd_pins StreamingDataflowPartition_1_StreamingDataWidthConverter_Batch_2/ap_clk] \
  [get_bd_pins StreamingDataflowPartition_1_ConvolutionInputGenerator_2/ap_clk] \
  [get_bd_pins StreamingDataflowPartition_1_StreamingFIFO_3/ap_clk] \
  [get_bd_pins StreamingDataflowPartition_1_StreamingFCLayer_Batch_2/ap_clk] \
  [get_bd_pins StreamingDataflowPartition_1_ConvolutionInputGenerator_3/ap_clk] \
  [get_bd_pins StreamingDataflowPartition_1_StreamingFIFO_4/ap_clk] \
  [get_bd_pins StreamingDataflowPartition_1_StreamingFCLayer_Batch_3/ap_clk] \
  [get_bd_pins StreamingDataflowPartition_1_StreamingDataWidthConverter_Batch_3/ap_clk] \
  [get_bd_pins StreamingDataflowPartition_1_StreamingMaxPool_Batch_1/ap_clk] \
  [get_bd_pins StreamingDataflowPartition_1_StreamingDataWidthConverter_Batch_4/ap_clk] \
  [get_bd_pins StreamingDataflowPartition_1_ConvolutionInputGenerator_4/ap_clk] \
  [get_bd_pins StreamingDataflowPartition_1_StreamingFIFO_5/ap_clk] \
  [get_bd_pins StreamingDataflowPartition_1_StreamingFCLayer_Batch_4/ap_clk] \
  [get_bd_pins StreamingDataflowPartition_1_StreamingDataWidthConverter_Batch_5/ap_clk] \
  [get_bd_pins StreamingDataflowPartition_1_ConvolutionInputGenerator_5/ap_clk] \
  [get_bd_pins StreamingDataflowPartition_1_StreamingFCLayer_Batch_5/ap_clk] \
  [get_bd_pins StreamingDataflowPartition_1_StreamingDataWidthConverter_Batch_6/ap_clk] \
  [get_bd_pins StreamingDataflowPartition_1_StreamingFCLayer_Batch_6/ap_clk] \
  [get_bd_pins StreamingDataflowPartition_1_StreamingDataWidthConverter_Batch_7/ap_clk] \
  [get_bd_pins StreamingDataflowPartition_1_StreamingFIFO_6/ap_clk] \
  [get_bd_pins StreamingDataflowPartition_1_StreamingFCLayer_Batch_7/ap_clk] \
  [get_bd_pins StreamingDataflowPartition_1_StreamingFIFO_7/ap_clk] \
  [get_bd_pins StreamingDataflowPartition_1_StreamingFCLayer_Batch_8/ap_clk] \
  [get_bd_pins StreamingDataflowPartition_1_StreamingDataWidthConverter_Batch_8/ap_clk] \
  [get_bd_pins StreamingDataflowPartition_1_LabelSelect_Batch_0/ap_clk] \
  [get_bd_pins StreamingDataflowPartition_1_StreamingFIFO_8/ap_clk]
connect_bd_net -net ap_rst_n_0_1 [get_bd_ports ap_rst_n] \
  [get_bd_pins StreamingDataflowPartition_1_StreamingFIFO_0/ap_rst_n] \
  [get_bd_pins StreamingDataflowPartition_1_Thresholding_Batch_0/ap_rst_n] \
  [get_bd_pins StreamingDataflowPartition_1_StreamingDataWidthConverter_Batch_0/ap_rst_n] \
  [get_bd_pins StreamingDataflowPartition_1_ConvolutionInputGenerator_0/ap_rst_n] \
  [get_bd_pins StreamingDataflowPartition_1_StreamingFIFO_1/ap_rst_n] \
  [get_bd_pins StreamingDataflowPartition_1_StreamingFCLayer_Batch_0/ap_rst_n] \
  [get_bd_pins StreamingDataflowPartition_1_ConvolutionInputGenerator_1/ap_rst_n] \
  [get_bd_pins StreamingDataflowPartition_1_StreamingFIFO_2/ap_rst_n] \
  [get_bd_pins StreamingDataflowPartition_1_StreamingFCLayer_Batch_1/ap_rst_n] \
  [get_bd_pins StreamingDataflowPartition_1_StreamingDataWidthConverter_Batch_1/ap_rst_n] \
  [get_bd_pins StreamingDataflowPartition_1_StreamingMaxPool_Batch_0/ap_rst_n] \
  [get_bd_pins StreamingDataflowPartition_1_StreamingDataWidthConverter_Batch_2/ap_rst_n] \
  [get_bd_pins StreamingDataflowPartition_1_ConvolutionInputGenerator_2/ap_rst_n] \
  [get_bd_pins StreamingDataflowPartition_1_StreamingFIFO_3/ap_rst_n] \
  [get_bd_pins StreamingDataflowPartition_1_StreamingFCLayer_Batch_2/ap_rst_n] \
  [get_bd_pins StreamingDataflowPartition_1_ConvolutionInputGenerator_3/ap_rst_n] \
  [get_bd_pins StreamingDataflowPartition_1_StreamingFIFO_4/ap_rst_n] \
  [get_bd_pins StreamingDataflowPartition_1_StreamingFCLayer_Batch_3/ap_rst_n] \
  [get_bd_pins StreamingDataflowPartition_1_StreamingDataWidthConverter_Batch_3/ap_rst_n] \
  [get_bd_pins StreamingDataflowPartition_1_StreamingMaxPool_Batch_1/ap_rst_n] \
  [get_bd_pins StreamingDataflowPartition_1_StreamingDataWidthConverter_Batch_4/ap_rst_n] \
  [get_bd_pins StreamingDataflowPartition_1_ConvolutionInputGenerator_4/ap_rst_n] \
  [get_bd_pins StreamingDataflowPartition_1_StreamingFIFO_5/ap_rst_n] \
  [get_bd_pins StreamingDataflowPartition_1_StreamingFCLayer_Batch_4/ap_rst_n] \
  [get_bd_pins StreamingDataflowPartition_1_StreamingDataWidthConverter_Batch_5/ap_rst_n] \
  [get_bd_pins StreamingDataflowPartition_1_ConvolutionInputGenerator_5/ap_rst_n] \
  [get_bd_pins StreamingDataflowPartition_1_StreamingFCLayer_Batch_5/ap_rst_n] \
  [get_bd_pins StreamingDataflowPartition_1_StreamingDataWidthConverter_Batch_6/ap_rst_n] \
  [get_bd_pins StreamingDataflowPartition_1_StreamingFCLayer_Batch_6/ap_rst_n] \
  [get_bd_pins StreamingDataflowPartition_1_StreamingDataWidthConverter_Batch_7/ap_rst_n] \
  [get_bd_pins StreamingDataflowPartition_1_StreamingFIFO_6/ap_rst_n] \
  [get_bd_pins StreamingDataflowPartition_1_StreamingFCLayer_Batch_7/ap_rst_n] \
  [get_bd_pins StreamingDataflowPartition_1_StreamingFIFO_7/ap_rst_n] \
  [get_bd_pins StreamingDataflowPartition_1_StreamingFCLayer_Batch_8/ap_rst_n] \
  [get_bd_pins StreamingDataflowPartition_1_StreamingDataWidthConverter_Batch_8/ap_rst_n] \
  [get_bd_pins StreamingDataflowPartition_1_LabelSelect_Batch_0/ap_rst_n] \
  [get_bd_pins StreamingDataflowPartition_1_StreamingFIFO_8/ap_rst_n]

validate_bd_design
save_bd_design
